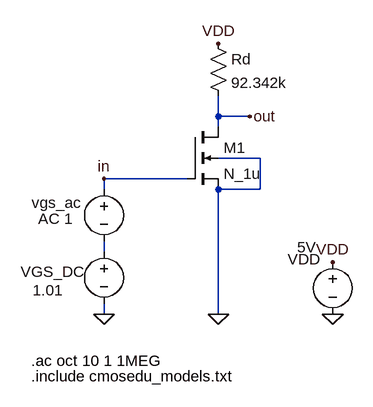
[diagram p0: schematic t4.asc]
t4.asc, the LTspice schematic file:
Version 4
SHEET 1 880 680
WIRE 208 96 208 64
WIRE 256 96 208 96
WIRE 208 112 208 96
WIRE 272 160 208 160
WIRE 160 192 32 192
WIRE 32 208 32 192
WIRE 272 208 272 160
WIRE 272 208 208 208
WIRE 32 304 32 288
WIRE 32 400 32 384
WIRE 208 400 208 208
FLAG 32 400 0
FLAG 208 400 0
FLAG 208 -16 VDD
FLAG 256 96 out
FLAG 384 400 0
FLAG 384 320 VDD
FLAG 32 192 in
SYMBOL voltage 32 288 R0
WINDOW 0 -128 47 Left 2
WINDOW 123 0 0 Left 2
WINDOW 39 0 0 Left 2
WINDOW 3 -110 75 Left 2
SYMATTR InstName VGS_DC
SYMATTR Value 1.01
SYMBOL nmos4 160 112 R0
SYMATTR InstName M1
SYMATTR Value N_1u
SYMATTR Value2 l=4.37u w=87.35u
SYMBOL voltage 32 192 R0
WINDOW 0 -111 37 Left 2
WINDOW 3 -118 -5 Left 2
WINDOW 123 -101 61 Left 2
WINDOW 39 0 0 Left 2
SYMATTR InstName vgs_ac
SYMATTR Value ""
SYMATTR Value2 AC 1
SYMBOL res 192 -32 R0
SYMATTR InstName Rd
SYMATTR Value 92.342k
SYMBOL voltage 384 304 R0
WINDOW 0 -69 12 Left 2
WINDOW 3 -55 -7 Left 2
WINDOW 123 0 0 Left 2
WINDOW 39 0 0 Left 2
SYMATTR InstName VDD
SYMATTR Value 5V
TEXT -80 496 Left 2 !.include cmosedu_models.txt
TEXT -80 472 Left 2 !.ac oct 10 1 1MEG

The netlist it stands for:
* t4.asc
VGS_DC N001 0 1.01
M1 out in 0 0 N_1u l=4.37u w=87.35u
vgs_ac in N001 AC 1
Rd VDD out 92.342k
VDD VDD 0 5V
.model NMOS NMOS
.model PMOS PMOS
.lib standard.mos
.include cmosedu_models.txt
.ac oct 10 1 1MEG
.backanno
.end